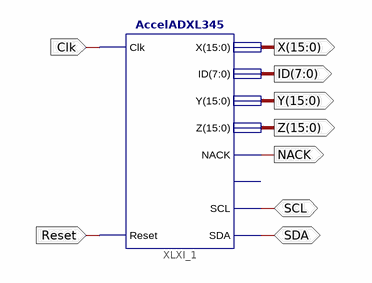
[diagram p0: schematic sheet 1]
// Xilinx ISE schematic AccelADXL.sch (xc9500xl) as structural Verilog: 1 symbols, 9 ports
module AccelADXL (
  input  Reset,
  input  Clk,
  inout  SCL,
  inout  SDA,
  output [15:0] X,
  output [7:0] ID,
  output [15:0] Y,
  output [15:0] Z,
  output NACK
);

  AccelADXL345 XLXI_1 (
    .Clk(Clk), .Reset(Reset), .X(X), .ID(ID), .Y(Y), .Z(Z), .NACK(NACK), .SCL(SCL), .SDA(SDA));  // open: BW_Tick
endmodule
